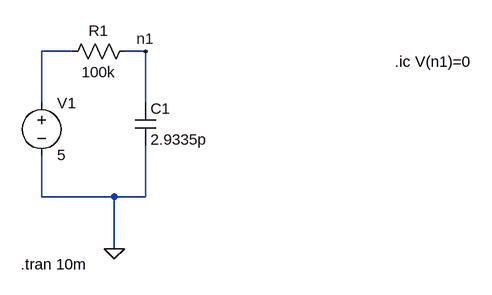
[diagram p0: schematic Draft46.asc]
Draft46.asc, the LTspice schematic file:
Version 4
SHEET 1 880 680
WIRE -96 0 -144 0
WIRE 16 0 -16 0
WIRE -144 80 -144 0
WIRE 16 80 16 0
WIRE -144 224 -144 160
WIRE -32 224 -144 224
WIRE 16 224 16 144
WIRE 16 224 -32 224
WIRE -32 304 -32 224
FLAG 16 0 n1
FLAG -32 304 0
SYMBOL cap 0 80 R0
SYMATTR InstName C1
SYMATTR Value 2.9335p
SYMBOL voltage -144 64 R0
WINDOW 123 0 0 Left 0
WINDOW 39 0 0 Left 0
SYMATTR InstName V1
SYMATTR Value 5
SYMBOL res 0 -16 R90
WINDOW 0 0 56 VBottom 2
WINDOW 3 32 56 VTop 2
SYMATTR InstName R1
SYMATTR Value 100k
TEXT -176 328 Left 2 !.tran 10m
TEXT 400 16 Left 2 !.ic V(n1)=0

The netlist it stands for:
* Draft46.asc
C1 n1 0 2.9335p
V1 N001 0 5
R1 n1 N001 100k
.tran 10m
.ic V(n1)=0
.backanno
.end

* Results of the author's LTspice run, read from the files saved beside the schematic
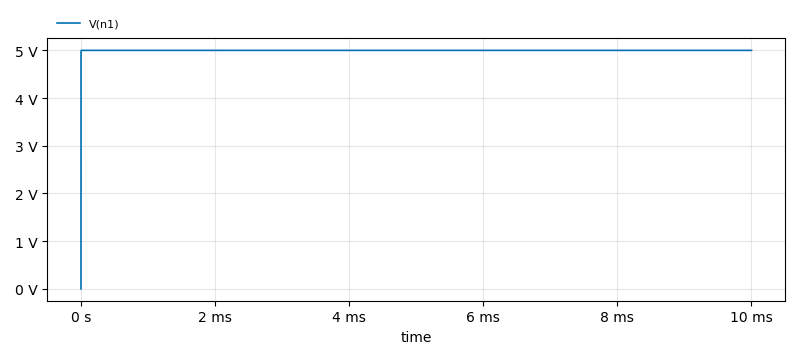
[diagram p1: Transient Analysis of Draft46.asc, plotted from the saved traces]
* Transient Analysis, 1 run:
*   V(n1): min 0 V, max 5 V, average 5 V, rms 5 V, last 5 V